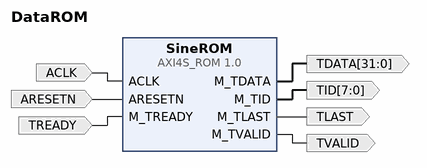
[diagram p0: block diagram of the top level]
# Vivado block design DataROM, xc7z010clg400-1, Vivado 2018.3
create_bd_design DataROM

create_bd_port -dir I -type clk ACLK
set_property -dict {CONFIG.FREQ_HZ 125000000} [get_bd_ports ACLK]
create_bd_port -dir I -type rst ARESETN
create_bd_port -dir I TREADY
create_bd_port -dir O TLAST
create_bd_port -dir O -from 7 -to 0 TID
create_bd_port -dir O -from 31 -to 0 TDATA
create_bd_port -dir O TVALID

create_bd_cell -type ip -vlnv www.kampis-elektroecke.de:Kampis-Elektroecke:AXI4S_ROM:1.0 SineROM

# ---- connections ----

connect_bd_net [get_bd_ports ACLK] [get_bd_pins SineROM/ACLK]
connect_bd_net [get_bd_ports ARESETN] [get_bd_pins SineROM/ARESETN]
connect_bd_net [get_bd_pins SineROM/M_TDATA] [get_bd_ports TDATA]
connect_bd_net [get_bd_pins SineROM/M_TLAST] [get_bd_ports TLAST]
connect_bd_net [get_bd_pins SineROM/M_TVALID] [get_bd_ports TVALID]
connect_bd_net [get_bd_ports TREADY] [get_bd_pins SineROM/M_TREADY]
connect_bd_net [get_bd_pins SineROM/M_TID] [get_bd_ports TID]

validate_bd_design
save_bd_design
